# Altium schematic sheet Module.SchDoc
size A4
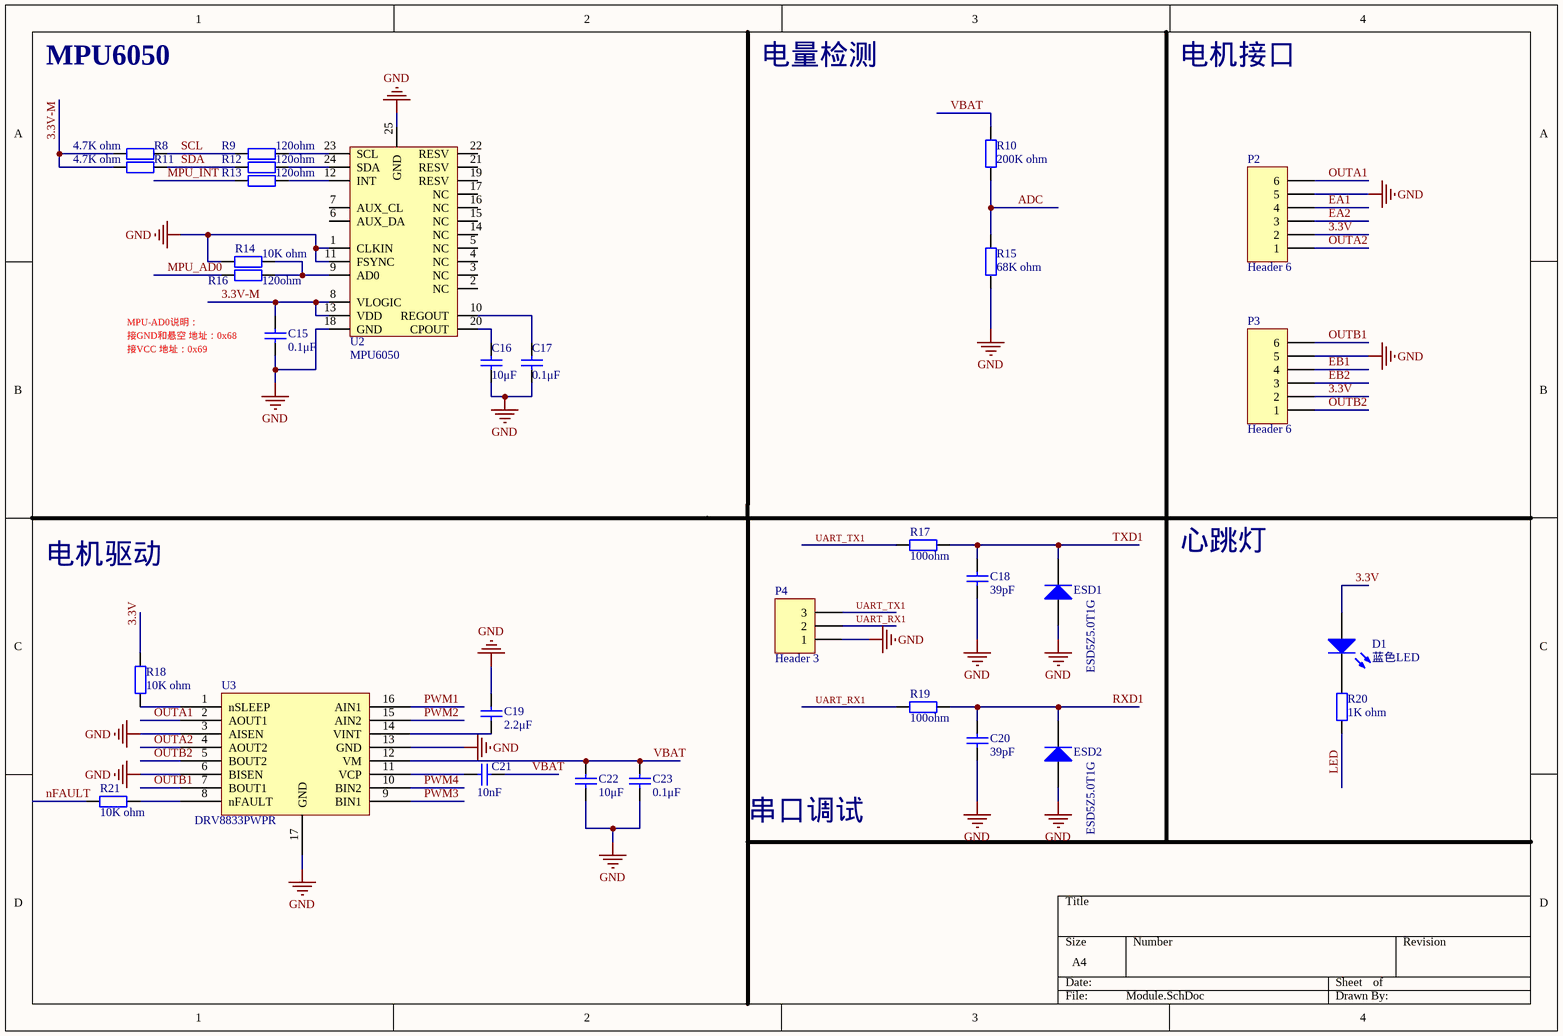
[diagram p0: Module.SchDoc]

## Parts
C15  0.1μF  [0603C]
C16  10μF  [0603C]
C17  0.1μF  [0603C]
C18  39pF  [0603C]
C19  2.2μF  [0603C]
C20  39pF  [0603C]
C21  10nF  [0603C]
C22  10μF  [0603C]
C23  0.1μF  [0603C]
D1  蓝色LED  [0603LED]
ESD1  ESD5Z5.0T1G  [SOD523]
ESD2  ESD5Z5.0T1G  [SOD523]
P2  Header 6  [HDR1X6]
P3  Header 6  [HDR1X6]
P4  Header 3  [HDR1X3]
R8  4.7K ohm  [0603R]
R9  120ohm  [0603R]
R10  200K ohm  [0603R]
R11  4.7K ohm  [0603R]
R12  120ohm  [0603R]
R13  120ohm  [0603R]
R14  10K ohm  [0603R]
R15  68K ohm  [0603R]
R16  120ohm  [0603R]
R17  100ohm  [0603R]
R18  10K ohm  [0603R]
R19  100ohm  [0603R]
R20  1K ohm  [0603R]
R21  10K ohm  [0603R]
U2  MPU6050  [QFN24]
U3  DRV8833PWPR  [TSSOP16]

## Nets
GND: C15.1 C16.1 C17.1 C18.1 C19.2 C20.1 C22.1 C23.1 ESD1.1(A) ESD2.1(A) P2.5 P3.5 P4.1 R14.1 R15.1 U2.1(CLKIN) U2.11(FSYNC) U2.18(GND) U2.25(GND) U3.3(AISEN) U3.6(BISEN) U3.13(GND) U3.17(GND)
3.3V: D1.1(A) P2.2 P3.2 R18.2
3.3V-M: C15.2 R8.1 R11.1 U2.8(VLOGIC) U2.13(VDD)
ADC: R10.1 R15.2
EA1: P2.4
EA2: P2.3
EB1: P3.4
EB2: P3.3
LED: R20.1
MPU_AD0: R16.1
MPU_INT: R13.1
nFAULT: R21.2
OUTA1: P2.6 U3.2(AOUT1)
OUTA2: P2.1 U3.4(AOUT2)
OUTB1: P3.6 U3.7(BOUT1)
OUTB2: P3.1 U3.5(BOUT2)
PWM1: U3.16(AIN1)
PWM2: U3.15(AIN2)
PWM3: U3.9(BIN1)
PWM4: U3.10(BIN2)
RXD1: C20.2 ESD2.2(K) R19.2
SCL: R8.2 R9.1
SDA: R11.2 R12.1
TXD1: C18.2 ESD1.2(K) R17.2
UART_RX1: P4.2 R19.1
UART_TX1: P4.3 R17.1
VBAT: C21.2 C22.2 C23.2 R10.2 U3.12(VM)
NetC16_2: C16.2 U2.20(CPOUT)
NetC17_2: C17.2 U2.10(REGOUT)
NetC19_1: C19.1 U3.14(VINT)
NetC21_1: C21.1 U3.11(VCP)
NetD1_2: D1.2(K) R20.2
NetR9_2: R9.2 U2.23(SCL)
NetR12_2: R12.2 U2.24(SDA)
NetR13_2: R13.2 U2.12(INT)
NetR14_2: R14.2 R16.2 U2.9(AD0)
NetR18_1: R18.1 U3.1(nSLEEP)
NetR21_1: R21.1 U3.8(nFAULT)

Not connected (* = marked no-connect by the designer): U2 2(NC) 3(NC) 4(NC) 5(NC) 6(AUX_DA) 7(AUX_CL) 14(NC) 15(NC) 16(NC) 17(NC) 19(RESV) 21(RESV) 22(RESV)

## Notes on the sheet
- MPU6050
- 电量检测
- 电机接口
- MPU-AD0说明：
- 接GND和悬空 地址：0x68
- 接VCC 地址：0x69
- 电机驱动
- 心跳灯
- 串口调试

## Library data of the parts
C15 C17 C23 = Cap_0.1μF_50V_0603: 0.1μF_50V,X7R,±5%; 物料名称: 贴片陶瓷电容; 制造商: muRata; 物料编码: TCC0087; 物料型号: GRM188R71H104JA93D; 单位: PCS; 物料规格: 0.1μF_50V,X7R,±5%
C16 C22 = Cap_10μF_35V_0603: 10μF_35V,X5R,20%; 物料规格: 10μF_35V,20%; 物料名称: 贴片陶瓷电容; 制造商: muRata; 物料编码: TCC0071; 物料型号: GRM188R6YA106MA73D; 单位: PCS
C18 C20 = Cap_39pF_50V_0603: 39pF_50V,C0G (EIA),±1%; 物料名称: 贴片陶瓷电容; 制造商: muRata; 物料编码: NA; 物料型号: GCM1885C1H390FA16; 单位: PCS; 物料规格: 39pF_50V,C0G (EIA),±1%
C19 = Cap_2.2uF_35V_0603: 2.2μF_35V,±10%; 物料名称: 贴片陶瓷电容; 制造商: TDK; 物料编码: NA; 物料型号: C1608JB1V225K080AC; 单位: PCS; 物料规格: 2.2μF_35V,±10%
C21 = Cap_10nF_50V_0603: 10nF_50V,SL_0603,±5%; 物料名称: 贴片陶瓷电容; 制造商: muRata; 物料编码: NA; 物料型号: GRM1881X1H103JA01; 单位: PCS; 物料规格: 10nF_50V,SL_0603,±5%
D1 = 蓝色LED: 物料规格: LED(蓝色）; 制造商: VISHAY; 物料编码: TRG0035; 物料型号: TLMB1100; 单位: PCS; 物料名称: LED(蓝色）
ESD1 ESD2 = ESD5Z5.0T1G_SOD523: 物料名称: ESD二极管; 制造商: 安森美; 物料编码: NA; 单位: PCS; 物料规格: ESD5Z5.0T1G; 物料型号: ESD5Z5.0T1G
P2 P3 = Header 6: Header, 6-Pin; LatestRevisionDate: 17-Jul-2002; LatestRevisionNote: Re-released for DXP Platform.; Publisher: Altium Limited
P4 = Header 3: Header, 3-Pin; LatestRevisionDate: 17-Jul-2002; LatestRevisionNote: Re-released for DXP Platform.; Publisher: Altium Limited
R8 R11 = Res_4.7K ohm_0603: 4.7K ohm,1%; 物料名称: 贴片电阻; 制造商: YAGEO; 物料型号: AA0603FR-074K7L; 单位: PCS; 物料规格: 4.7K ohm,1%
R9 R12 R13 R16 = Res_120ohm_0603: 120 ohm_5%; 物料名称: 贴片电阻; 制造商: YAGEO; 物料编码: NA; 单位: PCS; 物料规格: 120 ohm_5%; 物料型号: NA
R10 = Res_200K ohm_0603: 200K ohm,1%; 物料名称: 贴片电阻; 制造商: YAGEO; 物料编码: TRS0060; 物料型号: RC0603FR-07200KL; 单位: PCS; 物料规格: 200K ohm,1%
R14 R18 R21 = Res_10K ohm_0603: 10K ohm,1%; 物料名称: 贴片电阻; 制造商: YAGEO; 物料编码: TRS0020; 物料型号: RC0603FR-0710KL; 单位: PCS; 物料规格: 10K ohm,1%
R15 = Res_68K ohm_0603: 68K ohm,1%; 物料名称: 贴片电阻; 制造商: YAGEO; 物料编码: NA; 物料型号: RC0603FR-0768KL; 单位: PCS; 物料规格: 68K ohm,1%
R17 R19 = Res_100ohm_0603: 100 ohm_5%; 物料名称: 贴片电阻; 制造商: YAGEO; 物料编码: TRS0010; 物料型号: RC0603JR-07100R; 单位: PCS; 物料规格: 100 ohm_5%
R20 = Res_1K ohm_0603: 1K ohm,1%; 物料名称: 贴片电阻; 制造商: YAGEO; 物料编码: TRS0043; 物料型号: RC0603FR-071KL; 单位: PCS; 物料规格: 1K ohm,1%
U2 = MPU6050: 物料名称: 陀螺仪; 制造商: InvenSense; 物料编码: NA; 单位: PCS; 物料规格: MPU6050; 物料型号: MPU6050
U3 = DRV8833PWPR: 物料名称: 有刷直流电机驱动; 制造商: TI; 物料编码: NA; 单位: PCS; 物料规格: DRV8833PWPR; 物料型号: DRV8833PWPR